# EAGLE design interstage_A2v2 (EAGLE 9.2.2)
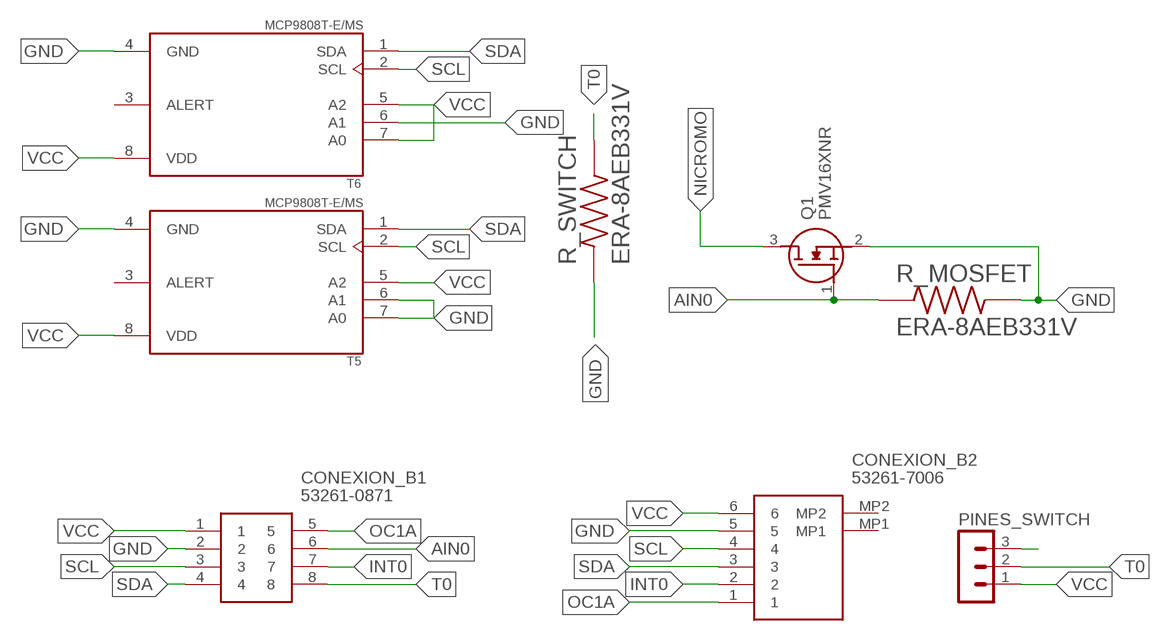
[diagram p0: schematic, sheet 1]

## Parts
CONEXION_B1  53261-0871  [53261-0871]
CONEXION_B2  53261-7006  [532617006]
PINES_SWITCH  MA03-1  [MA03-1]
Q1  PMV16XNR  [SOT95P230X110-3N]
R_MOSFET  ERA-8AEB331V  [RESC3216X70N]
R_SWITCH  ERA-8AEB331V  [RESC3216X70N]
T5  MCP9808T-E/MS  [SOP65P490X110-8N]
T6  MCP9808T-E/MS  [SOP65P490X110-8N]

## Nets
AIN0: CONEXION_B1.6 Q1.1(G) R_MOSFET.1
GND: CONEXION_B1.2 CONEXION_B2.5 Q1.2(S) R_MOSFET.2 R_SWITCH.1 T5.4(GND) T5.6(A1) T5.7(A0) T6.4(GND) T6.6(A1)
INT0: CONEXION_B1.7 CONEXION_B2.2
N$7: PINES_SWITCH.3
NICROMO: Q1.3(D)
OC1A: CONEXION_B1.5 CONEXION_B2.1
SCL: CONEXION_B1.3 CONEXION_B2.4 T5.2(SCL) T6.2(SCL)
SDA: CONEXION_B1.4 CONEXION_B2.3 T5.1(SDA) T6.1(SDA)
T0: CONEXION_B1.8 PINES_SWITCH.2 R_SWITCH.2
VCC: CONEXION_B1.1 CONEXION_B2.6 PINES_SWITCH.1 T5.5(A2) T5.8(VDD) T6.5(A2) T6.7(A0) T6.8(VDD)
Unconnected: CONEXION_B2.MP1 CONEXION_B2.MP2 T5.3(ALERT) T6.3(ALERT)

## Library data of the parts
CONEXION_B1 = SamacSys_Parts:53261-0871: Molex PICOBLADE Series, Series Number 53261, 1.25mm Pitch, 8 Way 1 Row Shrouded Right Angle PCB Header, Surface Mount Source: Datasheet <http://www.molex.com/webdocs/datasheets/pdf/en-us/0532610871_PCB_HEADERS.pdf>; DESCRIPTION: Molex PICOBLADE Series, Series Number 53261, 1.25mm Pitch, 8 Way 1 Row Shrouded Right Angle PCB Header, Surface Mount; HEIGHT: mm; MANUFACTURER_NAME: Molex; MANUFACTURER_PART_NUMBER: 53261-0871; MOUSER_PART_NUMBER: 538-53261-0871; MOUSER_PRICE-STOCK: https://www.mouser.co.uk/ProductDetail/Molex/53261-0871?qs=%252B72YyncTwW%252BggfdCJ7Netw%3D%3D
CONEXION_B2 = SamacSys_Parts:53261-7006: 1.25mm Pitch, PicoBlade PCB Header, Single Row, Right-Angle, Surface Mount, Gold (Au) Plating, Friction Lock, Circuits, Tape and Reel Source: Datasheet <https://componentsearchengine.com/Datasheets/1/53261-7006.pdf>; DESCRIPTION: 1.25mm Pitch, PicoBlade PCB Header, Single Row, Right-Angle, Surface Mount, Gold (Au) Plating, Friction Lock, Circuits, Tape and Reel; HEIGHT: 3.6mm; MANUFACTURER_NAME: Molex; MANUFACTURER_PART_NUMBER: 53261-7006; MOUSER_PART_NUMBER: 538-53261-7006; MOUSER_PRICE-STOCK: https://www.mouser.co.uk/ProductDetail/Molex/53261-7006?qs=0lSvoLzn4L%2FSBef0BTU2GA%3D%3D
PINES_SWITCH = con-lstb:MA03-1: PIN HEADER; OC_FARNELL: unknown; OC_NEWARK: unknown
Q1 = SamacSys_Parts:PMV16XNR: Nexperia PMV16XNR N-channel MOSFET, 8.6 A, 20 V PMV16XN, 3-Pin SOT-23 Source: Datasheet <https://componentsearchengine.com/Datasheets/1/PMV16XNR.pdf>; DESCRIPTION: Nexperia PMV16XNR N-channel MOSFET, 8.6 A, 20 V PMV16XN, 3-Pin SOT-23; HEIGHT: 1.1mm; MANUFACTURER_NAME: Nexperia; MANUFACTURER_PART_NUMBER: PMV16XNR; MOUSER_PART_NUMBER: 771-PMV16XNR; MOUSER_PRICE-STOCK: https://www.mouser.com/Search/Refine.aspx?Keyword=771-PMV16XNR
R_MOSFET R_SWITCH = resistor_330_smd:ERA-8AEB331V; DESCRIPTION: 330 Ohms ±0.1% 0.25W, 1/4W Chip Resistor 1206 (3216 Metric) Automotive AEC-Q200 Thin Film; DIGI-KEY_PART_NUMBER: P330BCCT-ND; MF: Panasonic Electronic; MP: ERA-8AEB331V; PACKAGE: 3216 Panasonic Electronic Components
T5 T6 = sensorSPEL:MCP9808T-E/MS: Board Mount Temperature Sensors Silicon temp sensor with I2C interface; DESCRIPTION: Temperature Sensor Digital, Local -40°C ~ 125°C 10 b 8-MSOP; DIGI-KEY_PART_NUMBER: MCP9808T-E/MSCT-ND; MF: Microchip; MP: MCP9808T-E/MS; PACKAGE: MSOP-8 Microchip

## Board
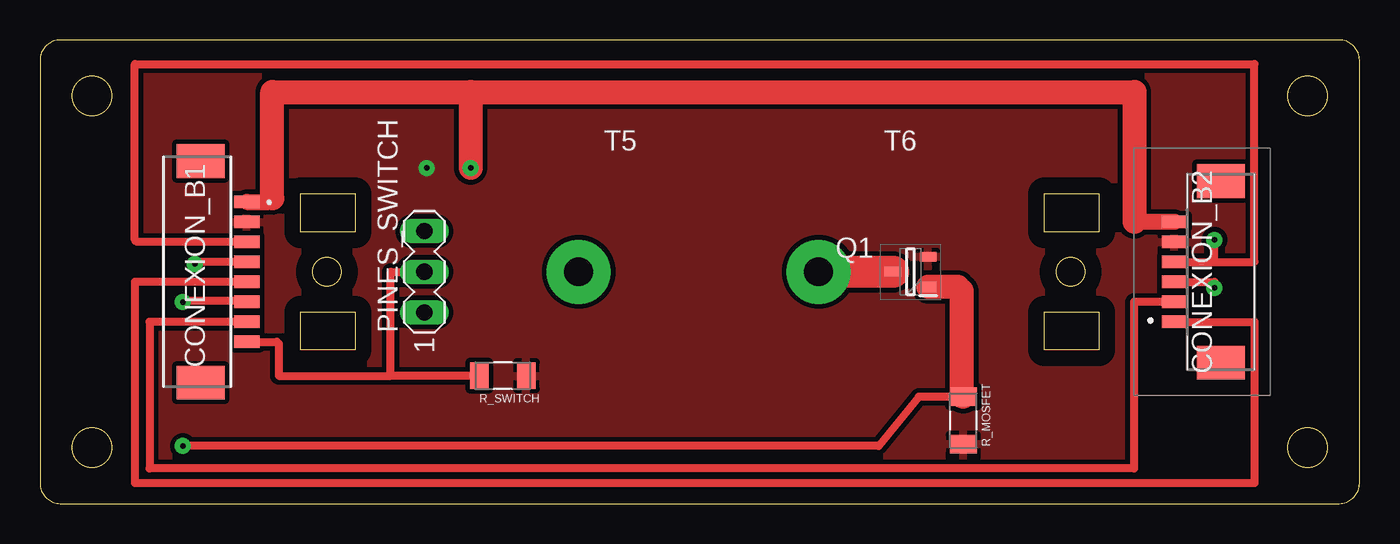
[diagram p1: board, top side]
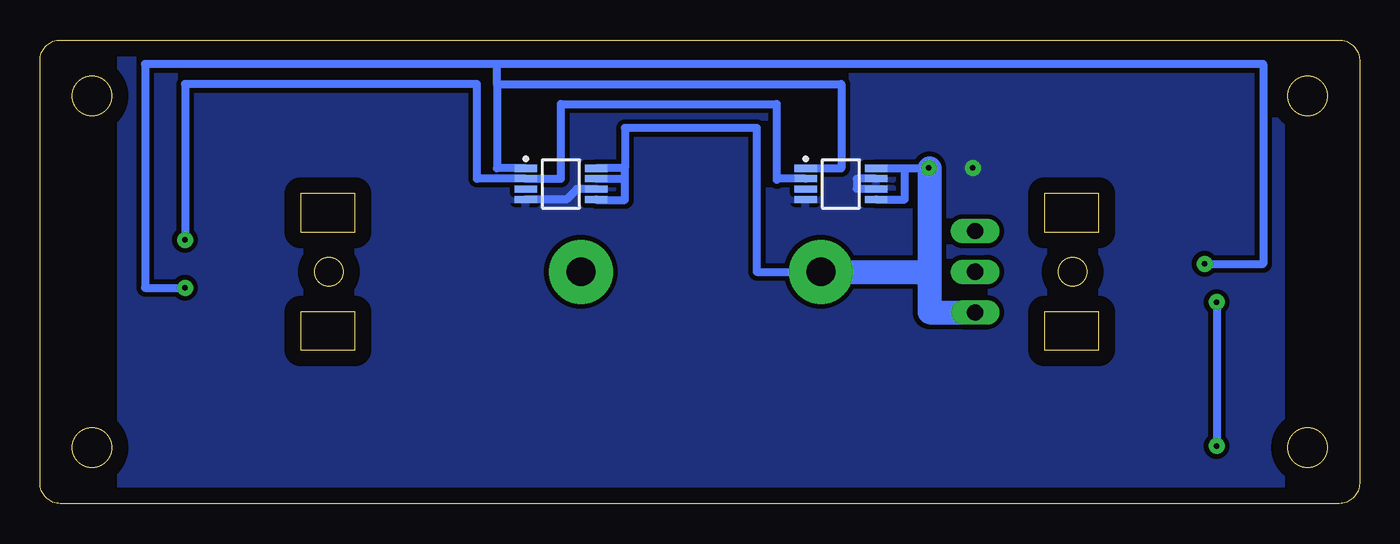
[diagram p2: board, bottom side, seen from below]

Size 82.5 x 29 mm. Coordinates in mm from the lower left corner, seen from the top.
Outline: 16.3,17 16.3,19.4 19.7,19.4 19.7,17 16.3,17
Outline: 62.8,9.6 62.8,12 66.2,12 66.2,9.6 62.8,9.6
Outline: 16.3,9.6 16.3,12 19.7,12 19.7,9.6 16.3,9.6
Outline: 62.8,17 62.8,19.4 66.2,19.4 66.2,17 62.8,17
Outline: 0,1.27 arc90 1.27,0 81.23,0 arc90 82.5,1.27 82.5,27.73 arc90 81.23,29 1.27,29 arc90 0,27.73 0,1.27
Outline: circle at 3.25,25.5 radius 1.25
Outline: circle at 79.25,3.5 radius 1.25
Outline: circle at 79.25,25.5 radius 1.25
Outline: circle at 3.25,3.5 radius 1.25
Outline: circle at 64.43,14.5 radius 0.9
Outline: circle at 17.93,14.5 radius 0.9
Copper layers (1*16): Top 0.035mm / dielectric 1.5mm / Bottom 0.035mm
Design rules "default *": minimum track width 6mil, minimum drill 0.35mm, track to track 0.3mm, track to pad 6mil, pad to pad 6mil, via to via 6mil, smd to smd 6mil, copper to edge 40mil, drill to drill 6mil, minimum pad ring 10mil, minimum via ring 8mil, stop-mask expansion 4mil, vias tented up to drill 0mil, thermal gap 10mil

### Footprints (pad centres in the part's own frame; a part is rotated, then mirrored left to right if it is on the bottom)
53261-0871 = smd 0.8 x 1.6: 1 -4.375,1.004; 2 -3.125,1.004; 3 -1.875,1.004; 4 -0.625,1.004; 5 0.625,1.004; 6 1.875,1.004; 7 3.125,1.004; 8 4.375,1.004 | smd 2.1 x 3: 9 6.925,-1.896; 10 -6.925,-1.896
532617006 = smd 0.8 x 1.6: 1 3.125,-2.5; 2 1.875,-2.5; 3 0.625,-2.5; 4 -0.625,-2.5; 5 -1.875,-2.5; 6 -3.125,-2.5 | smd 2.1 x 3: MP1 5.675,0.4; MP2 -5.675,0.4
MA03-1 = drill 1.016 long: 1 -2.54,0; 2 0,0; 3 2.54,0
SOT95P230X110-3N = smd 1.05 x 0.6: 1 -1.1,0.95; 2 -1.1,-0.95; 3 1.1,0
RESC3216X70N = smd 1.16 x 1.68: 1 -1.475,0; 2 1.475,0
SOP65P490X110-8N = smd 1.4 x 0.45: 1 -2.2,0.975; 2 -2.2,0.325; 3 -2.2,-0.325; 4 -2.2,-0.975; 5 2.2,-0.975; 6 2.2,-0.325; 7 2.2,0.325; 8 2.2,0.975

### Placement (x,y rotation side)
CONEXION_B1  11.93,14.5 270 top
CONEXION_B2  73.43,14.5 270 top
PINES_SWITCH  24.03,14.5 90 top
Q1  54.43,14.5 180 top
R_MOSFET  57.73,5.2 270 top
R_SWITCH  28.93,8 180 top
T5  32.43,20 0 bottom
T6  49.93,20 0 bottom

### Tracks (layer width: path | path; a pad name or v marks a point on that pad's centre or on a via)
AIN0  (via drill 0.35 pad 1)
  Top 0.5: 57.63,13.3 57.38,13.55 | v8.93,12.6 8.85,12.68 12.88,12.68 CONEXION_B1.6 | R_MOSFET.1 54.95,6.67 52.44,3.6 v8.93,3.6
  Top 1.5: R_MOSFET.1 57.63,6.7 57.63,13.3 | 57.38,13.55 Q1.1
  Bottom 0.5: v8.93,12.6 v8.93,3.6
GND  (via drill 0.35 pad 1)
  Bottom 0.5: T5.6 31.43,19.68 31.43,20.32 T5.7 | T6.6 48.93,19.68 49.58,19.02 T6.4
  other vias: 24.18,21
  pour Top (isolate 0.25): 4.93,28.3 4.93,0.5 77.43,0.5 77.43,28.3
  pour Bottom (isolate 0.25): 4.93,28.2 4.93,0.5 77.43,0.5 77.43,28.2
INT0
  Top 0.5: CONEXION_B1.7 6.85,11.38 6.85,2.19 68.41,2.19 68.41,12.62 CONEXION_B2.2
NICROMO  (via drill 1.8 pad 4)
  Top 2: Q1.3 v48.68,14.5
OC1A
  Top 0.5: CONEXION_B1.5 5.93,13.88 5.93,1.27 75.93,1.27 75.93,11.38 CONEXION_B2.1
SCL  (via drill 0.35 pad 1)
  Top 0.5: CONEXION_B1.3 6.05,16.38 5.93,16.5 5.93,27.5 75.93,27.5 75.93,15.12 73.43,15.12 | CONEXION_B2.4 73.43,15.12 | 73.43,15.12 v73.43,16.5
  Bottom 0.5: v73.43,16.5 73.43,26.25 55.18,26.25 55.18,20.32 T6.2 49.93,20.32 49.93,25 36.43,25 36.43,20.25 36.35,20.32 T5.2
SDA  (via drill 0.35 pad 1)
  Top 0.5: CONEXION_B1.4 9.8,15.12 v9.68,15 | CONEXION_B2.3 73.43,13.88 v73.43,13.5
  Bottom 0.5: T6.1 53.93,20.98 53.93,26.25 | 53.93,26.25 32.41,26.25 32.41,20.98 T5.1 | v9.68,15 6.03,15 6.03,27.5 53.93,27.5 | v73.43,13.5 75.93,13.5 75.93,27.5 53.93,27.5 | 53.93,26.25 53.93,27.5
T0
  Top 0.5: 21.93,8 21.93,14.5 PINES_SWITCH.2 | R_SWITCH.2 21.93,8 | CONEXION_B1.8 14.8,10.12 14.93,10 14.93,8 21.93,8
VCC  (via drill 0.35 pad 1, 1.8 pad 4)
  Top 0.5: 14.3,18.88 14.53,19.1
  Top 1: CONEXION_B1.1 14.3,18.88 | CONEXION_B2.6 68.43,17.62
  Top 1.5: 14.53,19.1 14.53,25.75 26.93,25.75 | 68.43,17.62 68.43,25.75 26.93,25.75 | 26.93,25.75 v26.93,21
  Bottom 0.5: T5.8 28.43,20.98 | 45.93,20.98 T6.8 | v26.93,21 26.41,21 26.39,20.98 26.89,20.98 28.43,20.98 | 45.93,20.98 45.93,23.5 37.68,23.5 37.68,14.5 v33.68,14.5 | T5.5 28.43,19.02 28.43,20.98 | T6.5 47.7,19 45.93,19 45.93,20.5 | 45.93,20.5 45.93,20.98 | T6.7 46.1,20.32 45.93,20.5
  Bottom 1.5: 26.89,20.98 26.89,14.5 | v33.68,14.5 26.89,14.5 | 26.89,14.5 26.89,11.96 PINES_SWITCH.1